# Altium project Digital Clock.PrjPcb
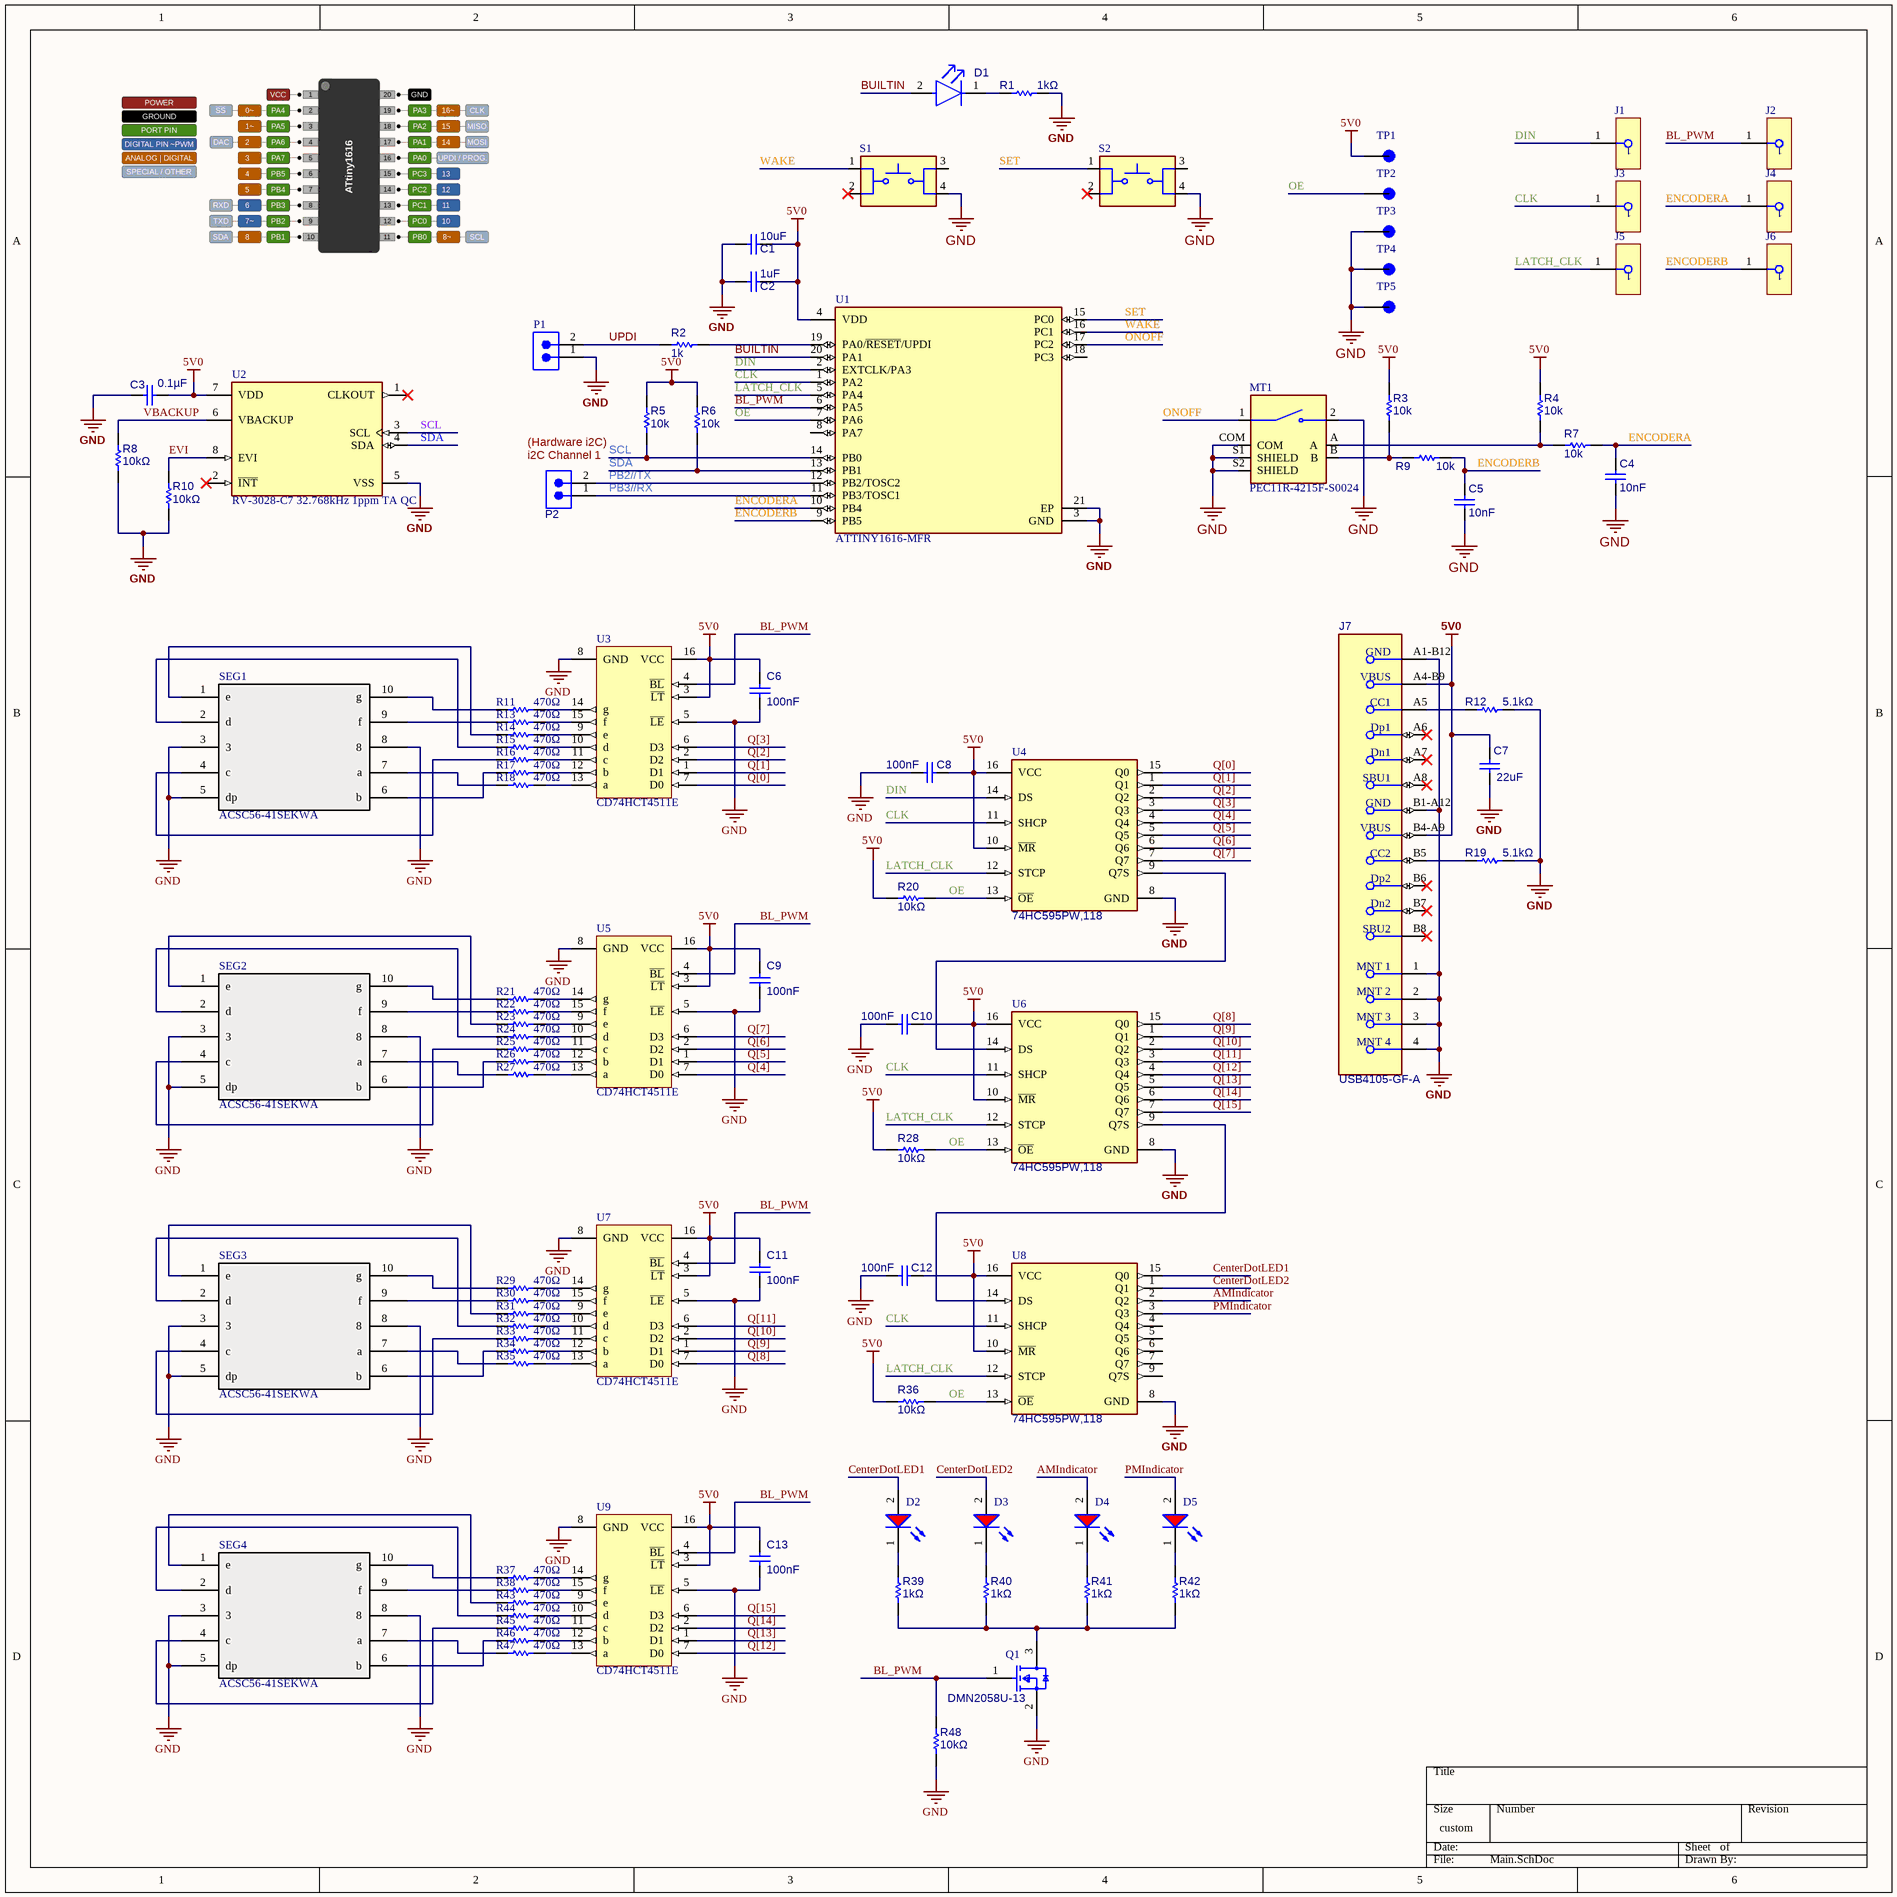
[diagram p0: Main.SchDoc]
1 sheet, 97 parts. Net scope: global (net labels, ports and power ports of the same name join across sheets).
Board file: Main.PcbDoc

## Sheet Main.SchDoc
size 381 x 381 mm; SheetNumber: 1; SheetTotal: 1

### Parts
C1  10uF  [WCAP-CSGP_0603_L1.6W0.8H0.8_Reflow]
C2  1uF  [WCAP-CSGP_0603_L1.6W0.8H0.8_Reflow]
C3  0.1µF  [WCAP-CSGP_0603_L1.6W0.8H0.8_Reflow]
C4  10nF  [WCAP-CSGP_0603_L1.6W0.8H0.8_Reflow]
C5  10nF  [WCAP-CSGP_0603_L1.6W0.8H0.8_Reflow]
C6  100nF  [WCAP-CSGP_0603_L1.6W0.8H0.8_Reflow]
C7  22uF  [WCAP-CSGP_0603_L1.6W0.8H0.8_Reflow]
C8  100nF  [WCAP-CSGP_0603_L1.6W0.8H0.8_Reflow]
C9  100nF  [WCAP-CSGP_0603_L1.6W0.8H0.8_Reflow]
C10  100nF  [WCAP-CSGP_0603_L1.6W0.8H0.8_Reflow]
C11  100nF  [WCAP-CSGP_0603_L1.6W0.8H0.8_Reflow]
C12  100nF  [WCAP-CSGP_0603_L1.6W0.8H0.8_Reflow]
C13  100nF  [WCAP-CSGP_0603_L1.6W0.8H0.8_Reflow]
D1  LTST-C190KGKT  [FP-LTST-C190KGKT-MFG]  (value not drawn)
D2  150120RS75000  [WL-SMCW_1206_150120xx75000]  (value not drawn)
D3  150120RS75000  [WL-SMCW_1206_150120xx75000]  (value not drawn)
D4  150120RS75000  [WL-SMCW_1206_150120xx75000]  (value not drawn)
D5  150120RS75000  [WL-SMCW_1206_150120xx75000]  (value not drawn)
J1  5019  [5019_MFG]  (value not drawn)
J2  5019  [5019_MFG]  (value not drawn)
J3  5019  [5019_MFG]  (value not drawn)
J4  5019  [5019_MFG]  (value not drawn)
J5  5019  [5019_MFG]  (value not drawn)
J6  5019  [5019_MFG]  (value not drawn)
J7  USB4105-GF-A  [FP-USB4105-GF-A-MFG]
MT1  PEC11R-4215F-S0024  [XDCR_PEC11R-4215F-S0024]
P1  61300211121  [61300211121]  (value not drawn)
P2  61300211121  [61300211121]  (value not drawn)
Q1  DMN2058U-13  [FP-C04-17458-MFG]
R1  1kΩ  [RESC1608X55X25NL10T15]
R2  1k  [RESC1608X55X25NL10T15]
R3  10k  [RESC1608X55X25NL10T15]
R4  10k  [RESC1608X55X25NL10T15]
R5  10k  [RESC1608X55X25NL10T15]
R6  10k  [RESC1608X55X25NL10T15]
R7  10k  [RESC1608X55X25NL10T15]
R8  10kΩ  [RESC1608X55X25NL10T15]
R9  10k  [RESC1608X55X25NL10T15]
R10  10kΩ  [RESC1608X55X25NL10T15]
R11  470Ω  [RESC3216X70X50NL05T20]
R12  5.1kΩ  [RESC1608X55X25NL10T15]
R13  470Ω  [RESC3216X70X50NL05T20]
R14  470Ω  [RESC3216X70X50NL05T20]
R15  470Ω  [RESC3216X70X50NL05T20]
R16  470Ω  [RESC3216X70X50NL05T20]
R17  470Ω  [RESC3216X70X50NL05T20]
R18  470Ω  [RESC3216X70X50NL05T20]
R19  5.1kΩ  [RESC1608X55X25NL10T15]
R20  10kΩ  [RESC1608X55X25NL10T15]
R21  470Ω  [RESC3216X70X50NL05T20]
R22  470Ω  [RESC3216X70X50NL05T20]
R23  470Ω  [RESC3216X70X50NL05T20]
R24  470Ω  [RESC3216X70X50NL05T20]
R25  470Ω  [RESC3216X70X50NL05T20]
R26  470Ω  [RESC3216X70X50NL05T20]
R27  470Ω  [RESC3216X70X50NL05T20]
R28  10kΩ  [RESC1608X55X25NL10T15]
R29  470Ω  [RESC3216X70X50NL05T20]
R30  470Ω  [RESC3216X70X50NL05T20]
R31  470Ω  [RESC3216X70X50NL05T20]
R32  470Ω  [RESC3216X70X50NL05T20]
R33  470Ω  [RESC3216X70X50NL05T20]
R34  470Ω  [RESC3216X70X50NL05T20]
R35  470Ω  [RESC3216X70X50NL05T20]
R36  10kΩ  [RESC1608X55X25NL10T15]
R37  470Ω  [RESC3216X70X50NL05T20]
R38  470Ω  [RESC3216X70X50NL05T20]
R39  1kΩ  [RESC1608X55X25NL10T15]
R40  1kΩ  [RESC1608X55X25NL10T15]
R41  1kΩ  [RESC1608X55X25NL10T15]
R42  1kΩ  [RESC1608X55X25NL10T15]
R43  470Ω  [RESC3216X70X50NL05T20]
R44  470Ω  [RESC3216X70X50NL05T20]
R45  470Ω  [RESC3216X70X50NL05T20]
R46  470Ω  [RESC3216X70X50NL05T20]
R47  470Ω  [RESC3216X70X50NL05T20]
R48  10kΩ  [RESC1608X55X25NL10T15]
S1  SWT0325-073016TSK_REVA  [SW_SWT0325-073016TSK_REVA]  (value not drawn)
S2  SWT0325-073016TSK_REVA  [SW_SWT0325-073016TSK_REVA]  (value not drawn)
SEG1  ACSC56-41SEKWA  [ACSC56-41SEKWA]
SEG2  ACSC56-41SEKWA  [ACSC56-41SEKWA]
SEG3  ACSC56-41SEKWA  [ACSC56-41SEKWA]
SEG4  ACSC56-41SEKWA  [ACSC56-41SEKWA]
TP1  1035  [KEYSTONE_1035]  (value not drawn)
TP2  1035  [KEYSTONE_1035]  (value not drawn)
TP3  1035  [KEYSTONE_1035]  (value not drawn)
TP4  1035  [KEYSTONE_1035]  (value not drawn)
TP5  1035  [KEYSTONE_1035]  (value not drawn)
U1  ATTINY1616-MFR  [FP-C04-21380-MFG]
U2  RV-3028-C7 32.768kHz 1ppm TA QC  [FP-RV-3028-C7_32_768kHz_1-MFG]
U3  CD74HCT4511E  [N0016A]
U4  74HC595PW,118  [FP-SOT403-1-MFG]
U5  CD74HCT4511E  [N0016A]
U6  74HC595PW,118  [FP-SOT403-1-MFG]
U7  CD74HCT4511E  [N0016A]
U8  74HC595PW,118  [FP-SOT403-1-MFG]
U9  CD74HCT4511E  [N0016A]

### Nets
5V0: C1.2 C2.2 C3.1 C6.2 C7.2 C8.2 C9.2 C10.2 C11.2 C12.2 C13.2 J7.A4-B9(VBUS) J7.B4-A9(VBUS) R3.2 R4.2 R5.2 R6.2 R20.1 R28.1 R36.1 TP1.TP U1.4(VDD) U2.7(VDD) U3.3(~{LT}) U3.16(VCC) U4.10(~{MR}) U4.16(VCC) U5.3(~{LT}) U5.16(VCC) U6.10(~{MR}) U6.16(VCC) U7.3(~{LT}) U7.16(VCC) U8.10(~{MR}) U8.16(VCC) U9.3(~{LT}) U9.16(VCC)
GND: C1.1 C2.1 C3.2 C4.2 C5.2 C6.1 C7.1 C8.1 C9.1 C10.1 C11.1 C12.1 C13.1 J7.1(MNT_1) J7.2(MNT_2) J7.3(MNT_3) J7.4(MNT_4) J7.A1-B12(GND) J7.B1-A12(GND) MT1.2 MT1.COM MT1.S1(SHIELD) MT1.S2(SHIELD) P1.1 Q1.2(S) R1.1 R8.1 R10.1 R12.1 R19.1 R48.1 S1.4 S2.4 SEG1.3 SEG1.5(dp) SEG1.8 SEG2.3 SEG2.5(dp) SEG2.8 SEG3.3 SEG3.5(dp) SEG3.8 SEG4.3 SEG4.5(dp) SEG4.8 TP3.TP TP4.TP TP5.TP U1.3(GND) U1.21(EP) U2.5(VSS) U3.5(~{LE}) U3.8(GND) U4.8(GND) U5.5(~{LE}) U5.8(GND) U6.8(GND) U7.5(~{LE}) U7.8(GND) U8.8(GND) U9.5(~{LE}) U9.8(GND)
AMIndicator: D4.2(A) U8.2(Q2)
BL_PWM: J2.1 Q1.1(G) R48.2 U1.6(PA5) U3.4(~{BL}) U5.4(~{BL}) U7.4(~{BL}) U9.4(~{BL})
BUILTIN: D1.2(A) U1.20(PA1)
CenterDotLED1: D2.2(A) U8.15(Q0)
CenterDotLED2: D3.2(A) U8.1(Q1)
CLK: J3.1 U1.1(PA2) U4.11(SHCP) U6.11(SHCP) U8.11(SHCP)
DIN: J1.1 U1.2(EXTCLK/PA3) U4.14(DS)
ENCODERA: C4.1 J4.1 R7.2 U1.10(PB4)
ENCODERB: C5.1 J6.1 R9.2 U1.9(PB5)
EVI: R10.2 U2.8(EVI)
LATCH_CLK: J5.1 U1.5(PA4) U4.12(STCP) U6.12(STCP) U8.12(STCP)
OE: R20.2 R28.2 R36.2 TP2.TP U1.7(PA6) U4.13(~{OE}) U6.13(~{OE}) U8.13(~{OE})
ONOFF: MT1.1 U1.17(PC2)
PB2//TX: P2.2 U1.12(PB2/TOSC2)
PB3//RX: P2.1 U1.11(PB3/TOSC1)
PMIndicator: D5.2(A) U8.3(Q3)
Q[0]: U3.7(D0) U4.15(Q0)
Q[1]: U3.1(D1) U4.1(Q1)
Q[2]: U3.2(D2) U4.2(Q2)
Q[3]: U3.6(D3) U4.3(Q3)
Q[4]: U4.4(Q4) U5.7(D0)
Q[5]: U4.5(Q5) U5.1(D1)
Q[6]: U4.6(Q6) U5.2(D2)
Q[7]: U4.7(Q7) U5.6(D3)
Q[8]: U6.15(Q0) U7.7(D0)
Q[9]: U6.1(Q1) U7.1(D1)
Q[10]: U6.2(Q2) U7.2(D2)
Q[11]: U6.3(Q3) U7.6(D3)
Q[12]: U6.4(Q4) U9.7(D0)
Q[13]: U6.5(Q5) U9.1(D1)
Q[14]: U6.6(Q6) U9.2(D2)
Q[15]: U6.7(Q7) U9.6(D3)
SCL: R5.1 U1.14(PB0) U2.3(SCL)
SDA: R6.1 U1.13(PB1) U2.4(SDA)
SET: S2.1 U1.15(PC0)
UPDI: P1.2 R2.1
VBACKUP: R8.2 U2.6(VBACKUP)
WAKE: S1.1 U1.16(PC1)
NetD1_1: D1.1(C) R1.2
NetD2_1: D2.1(K) R39.2
NetD3_1: D3.1(K) R40.2
NetD4_1: D4.1(K) R41.2
NetD5_1: D5.1(K) R42.2
NetJ7_A5: J7.A5(CC1) R12.2
NetJ7_B5: J7.B5(CC2) R19.2
NetMT1_A: MT1.A R4.1 R7.1
NetMT1_B: MT1.B R3.1 R9.1
NetQ1_3: Q1.3(D) R39.1 R40.1 R41.1 R42.1
NetR2_2: R2.2 U1.19(PA0/~{RESET}/UPDI)
NetR11_1: R11.1 SEG1.10(g)
NetR11_2: R11.2 U3.14(g)
NetR13_1: R13.1 SEG1.9(f)
NetR13_2: R13.2 U3.15(f)
NetR14_1: R14.1 SEG1.1(e)
NetR14_2: R14.2 U3.9(e)
NetR15_1: R15.1 SEG1.2(d)
NetR15_2: R15.2 U3.10(d)
NetR16_1: R16.1 SEG1.4(c)
NetR16_2: R16.2 U3.11(c)
NetR17_1: R17.1 SEG1.6(b)
NetR17_2: R17.2 U3.12(b)
NetR18_1: R18.1 SEG1.7(a)
NetR18_2: R18.2 U3.13(a)
NetR21_1: R21.1 SEG2.10(g)
NetR21_2: R21.2 U5.14(g)
NetR22_1: R22.1 SEG2.9(f)
NetR22_2: R22.2 U5.15(f)
NetR23_1: R23.1 SEG2.1(e)
NetR23_2: R23.2 U5.9(e)
NetR24_1: R24.1 SEG2.2(d)
NetR24_2: R24.2 U5.10(d)
NetR25_1: R25.1 SEG2.4(c)
NetR25_2: R25.2 U5.11(c)
NetR26_1: R26.1 SEG2.6(b)
NetR26_2: R26.2 U5.12(b)
NetR27_1: R27.1 SEG2.7(a)
NetR27_2: R27.2 U5.13(a)
NetR29_1: R29.1 SEG3.10(g)
NetR29_2: R29.2 U7.14(g)
NetR30_1: R30.1 SEG3.9(f)
NetR30_2: R30.2 U7.15(f)
NetR31_1: R31.1 SEG3.1(e)
NetR31_2: R31.2 U7.9(e)
NetR32_1: R32.1 SEG3.2(d)
NetR32_2: R32.2 U7.10(d)
NetR33_1: R33.1 SEG3.4(c)
NetR33_2: R33.2 U7.11(c)
NetR34_1: R34.1 SEG3.6(b)
NetR34_2: R34.2 U7.12(b)
NetR35_1: R35.1 SEG3.7(a)
NetR35_2: R35.2 U7.13(a)
NetR37_1: R37.1 SEG4.10(g)
NetR37_2: R37.2 U9.14(g)
NetR38_1: R38.1 SEG4.9(f)
NetR38_2: R38.2 U9.15(f)
NetR43_1: R43.1 SEG4.1(e)
NetR43_2: R43.2 U9.9(e)
NetR44_1: R44.1 SEG4.2(d)
NetR44_2: R44.2 U9.10(d)
NetR45_1: R45.1 SEG4.4(c)
NetR45_2: R45.2 U9.11(c)
NetR46_1: R46.1 SEG4.6(b)
NetR46_2: R46.2 U9.12(b)
NetR47_1: R47.1 SEG4.7(a)
NetR47_2: R47.2 U9.13(a)
NetU4_9: U4.9(Q7S) U6.14(DS)
NetU6_9: U6.9(Q7S) U8.14(DS)

Not connected (* = marked no-connect by the designer): J7 A6(Dp1)* A7(Dn1)* A8(SBU1)* B6(Dp2)* B7(Dn2)* B8(SBU2)*; S1 2* 3; S2 2* 3; U1 8(PA7) 18(PC3); U2 1(CLKOUT)* 2(~{INT})*; U8 4(Q4) 5(Q5) 6(Q6) 7(Q7) 9(Q7S)

### Notes on the sheet
- (near P2) i2C Channel 1
- (Hardware i2C)

### Library data of the parts
C1-C13 = CMP-207839-000060-3: 10V tolerance
D1 = CMP-2000-05197-2: LED GREEN CLEAR CHIP SMD; Test Current: 20mA; Power Rating: 75mW; Forward Voltage: 2V; Wavelength: 574nm; Number of LEDs: 1; Reverse Voltage: 5V; Dominant Wavelength: 571nm; Lens Style: Diffused; Luminous Intensity: 35mcd; Forward Current: 30mA; Viewing Angle: 130°; Lens Color: Colorless; Width: 0.8mm; Case Code (Imperial): 0603; Case Code (Metric): 1608; Number of Pins: 2; Radiation Hardening: No; Package Quantity: 1; Lead Free: Lead Free; Lens Transparency: Clear; Depth: 0.8mm; Power Dissipation: 75mW; Mount: Surface Mount; Max Operating Temperature: 85°C; Case/Package: 0603; Height: 0.8mm; Illumination Color: Green; Color: Green; Length: 1.6mm; Packaging: Tape and Reel; Number of Elements: 1; Min Operating Temperature: -55°C
D2-D5 = CMP-1426-00013-4: WL-SMCW SMT Mono-Color Chip LED Waterclear; Luminous Intensity: 150mcd; Max Junction Temperature (Tj): 95°C; Lens Style: Clear, Rectangular; Color: Red; Wavelength: 625nm; Forward Current: 100mA; Test Current: 20mA; Power Dissipation: 72mW; Forward Voltage: 2V; Peak Wavelength: 630nm; Reverse Voltage: 5V; Viewing Angle: 140°; Length: 3.2mm; Case Code (Imperial): 1206; Mount: Surface Mount; Case/Package: 1206; Packaging: Tape and Reel; REACH SVHC: Unknown; Max Operating Temperature: 85°C; RoHS: Compliant; Height: 680µm; Dominant Wavelength: 625nm; Width: 1.6mm; Max Reverse Voltage (DC): 5V; Case Code (Metric): 3216; Min Operating Temperature: -40°C
J1-J6 = CMP-1672-00008-3: Phosphor Bronze Contact Miniature Silver Plated Surface Mount Test Points; Number of Contacts: 1; ComponentLink1Description: Manufacturer's Website; Number of Pins: 1; Height: 2.42mm; Mount: Surface Mount; HelpURL: https://www.keyelco.com/product-pdf.cfm?p=1357; REACH SVHC: Yes; Packaging: Tape and Reel; Lead Free: Lead Free; ComponentLink1URL: http://www.keyelco.com/; Termination: SMD/SMT; Material: Bronze; Contact Plating: Silver; Contact Material: Silver; RoHS: Compliant; ComponentLink2URL: https://www.keyelco.com/product-pdf.cfm?p=1357; China RoHS: Compliant; Lifecycle Status: Production; ComponentLink2Description: Datasheet URL
J7 = CMP-245163-000001-1: CONN RCPT USB2.0 TYPEC 5A; Manufacturer: GCT; Voltage Rating: 20V; Is Female: yes; Current Rating: 5/6.25/1.25/0.25A; Number Of Contacts: 16; Conn Orientation: Right Angle; Device Class L1: Connectors; Category: Conn; Lead Free: Yes; RoHS: TRUE; Temperature Range High: +85°C; Digikey Description: CONN RCPT USB2.0 TYPEC 5A; Device Class L3: unset; ComponentLink2Description: Datasheet; Manufacturer Part Number: USB4105-GF-A; Package: 0; Usb Standard: USB 2.0; Device Class L2: USB Connectors; Automotive: No; Temperature Range Low: -40°C; Height: 3.46mm; Temperature: -40°C to +85°C; Contact Material: Gold,Nickel; ComponentLink2URL: https://gct.co/files/drawings/usb4105.pdf; Octopart: https://octopart.com/usb4105-gf-a-gct-106627878
MT1 = PEC11R-4215F-S0024: Incremental Encoder, 12 Mm, Contact Rating 10 Ma - 5 Vdc; Price: None; Availability: Unavailable; MP: PEC11R-4215F-S0024; Value: *; Package: None
P1 = CMP-1712-00002-7: THT Vertical Pin Header WR-PHD, Pitch 2.54 mm, Single Row, 2 pins; Pitch: 2.54mm; Number of Contacts: 2; Connector Type: Male Pin; Gender: Male; Contact Resistance: 20mΩ; Operating Supply Voltage: 250V; Current Rating: 3A; Housing Material: PBT; RoHS: Compliant; Lead Free: Lead Free; Contact Material: Gold; REACH SVHC: No; Min Operating Temperature: -40°C; Termination: Through Hole; Number of Pins: 2; Contact Gender: Male; Packaging: Bulk; Lead Pitch: 2.54mm; Contact Plating: Gold; Orientation: Vertical; Mount: Through Hole; Height: 8.94mm; Color: Black; Number of Positions: 2; Contact Mating Length: 5.9944mm; Max Operating Temperature: 105°C; Voltage Rating: 250V; Number of Rows: 1
P2 = CMP-1712-00002-6: NexarPartId: 20081794; Number of Contacts: 2; Pitch: 2.54mm; Connector Type: Male Pin; Voltage Rating: 250V; Current Rating: 3A; Gender: Male; Contact Resistance: 20mΩ; Height: 8.94mm; Lead Free: Lead Free; Number of Pins: 2; Termination: Through Hole; RoHS: Compliant; Lead Pitch: 2.54mm; REACH SVHC: No SVHC; Housing Material: PBT; Contact Mating Length: 5.9944mm; Min Operating Temperature: -40°C; Orientation: Vertical; Contact Material: Copper; Contact Gender: Male; Max Operating Temperature: 125°C; Number of Rows: 1; Number of Positions: 2; Packaging: Bulk; Contact Plating: Gold; Mount: Through Hole; Color: Black; Operating Supply Voltage: 250V
Q1 = CMP-00252-47153607-1: TN2130K1-G Mosfet, N-Channel Enhancement-Mode, 300V, 25 Ohm Rohs Compliant: Yes; Gate to Source Voltage (Vgs): 20V; Drain to Source Resistance: 25Ω; Element Configuration: Single; Number of Channels: 1; Fall Time: 7ns; Turn-On Delay Time: 10ns; Turn-Off Delay Time: 12ns; Input Capacitance: 50pF; Power Dissipation: 360mW; Continuous Drain Current (ID): 85mA; Weight: 1.437803g; Rds On Max: 25Ω; Case/Package: SOT-23; Min Operating Temperature: -55°C; Length: 2.9mm; RoHS: Compliant; Lifecycle Status: Production; Height: 950µm; Drain to Source Voltage (Vdss): 300V; NexarPartId: 47153607; Rise Time: 7ns; Lead Free: Lead Free; Width: 1.3mm; Mount: Surface Mount; Number of Pins: 3; Drain to Source Breakdown Voltage: 300V; Radiation Hardening: No; Max Operating Temperature: 150°C; Number of Elements: 1; Max Power Dissipation: 360mW; Schedule B: 8541210080, 8541210080
R1-R10 R12 R19 R20 R28 R36 R39-R42 R48 = CMP-2000-04186-1
R11 R13-R18 R21-R27 R29-R35 R37 R38 R43-R47 = CMP-2003-00307-1: Part Number: ERJ8ENF3300V; Manufacturer: Panasonic
S1 S2 = SWT0325-073016TSK_REVA: 6mm x 6mm Through Hole Tactile Switch; MF: Global Connector Technology; SnapEDA_Link: https://www.snapeda.com/parts/SWT0325-073016TSK/Global+Connector+Technology/view-part/?ref=snap; Package: None; Value: *; MP: SWT0325-073016TSK; Check_prices: https://www.snapeda.com/parts/SWT0325-073016TSK/Global+Connector+Technology/view-part/?ref=eda
SEG1-SEG4 = ACSC56-41SEKWA: SMD 7-Segment Display
TP1-TP5 = 1035: Test Point PC Slotted THM Height .335 Brass/Tin | Keystone Electronics 1035; SnapEDA_Link: https://www.snapeda.com/parts/1035/Keystone/view-part/?ref=snap; Package: None; Value: *; MF: Keystone Electronics; MP: 1035; Check_prices: https://www.snapeda.com/parts/1035/Keystone/view-part/?ref=eda
U1 = CMP-06276-000228-1: IC MCU 8BIT 16KB FLASH 20VQFN; Interface: I2C; Frequency: 20MHz; Oscillator Type: Internal; Core Architecture: AVR; Number of I/Os: 18; Peripherals: Brown-out Detect/Reset; Memory Type: FLASH; Memory Size: 16KB; RoHS Compliant: Yes; Max Operating Temperature: 125°C; Case/Package: VQFN; Min Operating Temperature: -40°C; Packaging: Cut Tape
U2 = CMP-226158-000001-1: Real Time Clock Serial 2byte Clock/Calendar/Alarm/Timer/Battery Backup 8-Pin CSMD T/R; Manufacturer: Micro Crystal; Memory Size: 2Bytes; Number Of Outputs: 1; Nominal Supply Current: 0.04uA; Interface: I2C; Max Supply Voltage: 5.5V; Min Supply Voltage: 1.1V; Package: RV-3028-C7 32.768kHz 1ppm TA QC; Lead Free: Yes; RoHS: TRUE; Device Class L1: Integrated Circuits (ICs); Temperature: -40°C to +85°C; ComponentLink2Description: Datasheet; Height: 0.8mm; Octopart: https://octopart.com/rv-3028-c7+32.768khz+1ppm+ta+qc-micro+crystal-98880451; ComponentLink2URL: https://www.microcrystal.com/fileadmin/Media/Products/RTC/Datasheet/RV-3028-C7.pdf; Device Class L2: Clock and Timing; Temperature Range Low: -40°C; Temperature Range High: +85°C; Automotive: No; Device Class L3: Real Time Clocks; Manufacturer Part Number: RV-3028-C7 32.768kHz 1ppm TA QC; Frequency: 32.768kHz; Ambient Temperature Range High: +85°C; Ambient Temperature Range Low: -40°C; Category: IC; Mouser Description: RV-3028-C7 32.768KHZ 1PPM Ta Qc
U3 U5 U7 U9 = CMP-0388-00318-2: High Speed CMOS Logic BCD-to-7-Segment Latch / Decoder / Driver, 4.5 to 5.5 V, -55 to 125 degC, 16-pin DIP (N16), Pb-Free (RoHS); Manufacturer: Texas Instruments; SubFamily: Discrete Segment LED Driver; Rating: Catalog; Vin(Min)(V): 4.5; Vin(Max)(V): 5.5; PackageDescription: 16-Pin Plastic In-Line, Body 19.305 x 6.35 mm, Pitch 2.54 mm; ComponentLink3URL: http://www.ti.com/litv/pdf/mpdi002c; PackageVersion: 4040049/E; Mounting Technology: Through Hole; ComponentLink2Description: Datasheet; PartNumber: CD74HCT4511E; DatasheetVersion: SCHS279D; ComponentLink1Description: Manufacturer URL; Eco-Plan: Pb-Free (RoHS); Code_JEDEC: MS-001; PackageReference: N0016A; ComponentLink2URL: http://www.ti.com/general/docs/lit/getliterature.tsp?genericPartNumber=CD74HCT4511&fileType=pdf; ComponentLink3Description: Package Specification; ComponentLink1URL: http://www.ti.com/
U4 U6 U8 = CMP-14351-000004-1: IC SHIFT REGISTER 8BIT 16TSSOP